# Altium schematic sheet Res 470R.schdoc
size 44 x 27 mm
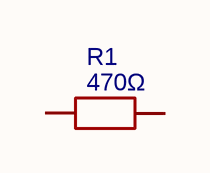
[diagram p0: Res 470R.schdoc]

## Parts
R1  470Ω  [R0603]

## Nets

Not connected (* = marked no-connect by the designer): R1 1 2

## Library data of the parts
R1 = 470Ω: Manufacturer: PANASONIC(松下); Manufacturer Part: ERJPA3F4700V; nameAlias: Value; Contributor: lcsc; Supplier: LCSC; Supplier Part: C441919; JLCPCB Part Class: Extended Part; spicePre: R; spiceSymbolName: ERJPA3F4700V